# Altium schematic sheet Sheet1-new.SchDoc: SMART METER - MainBoard
size A3; SheetNumber: 1
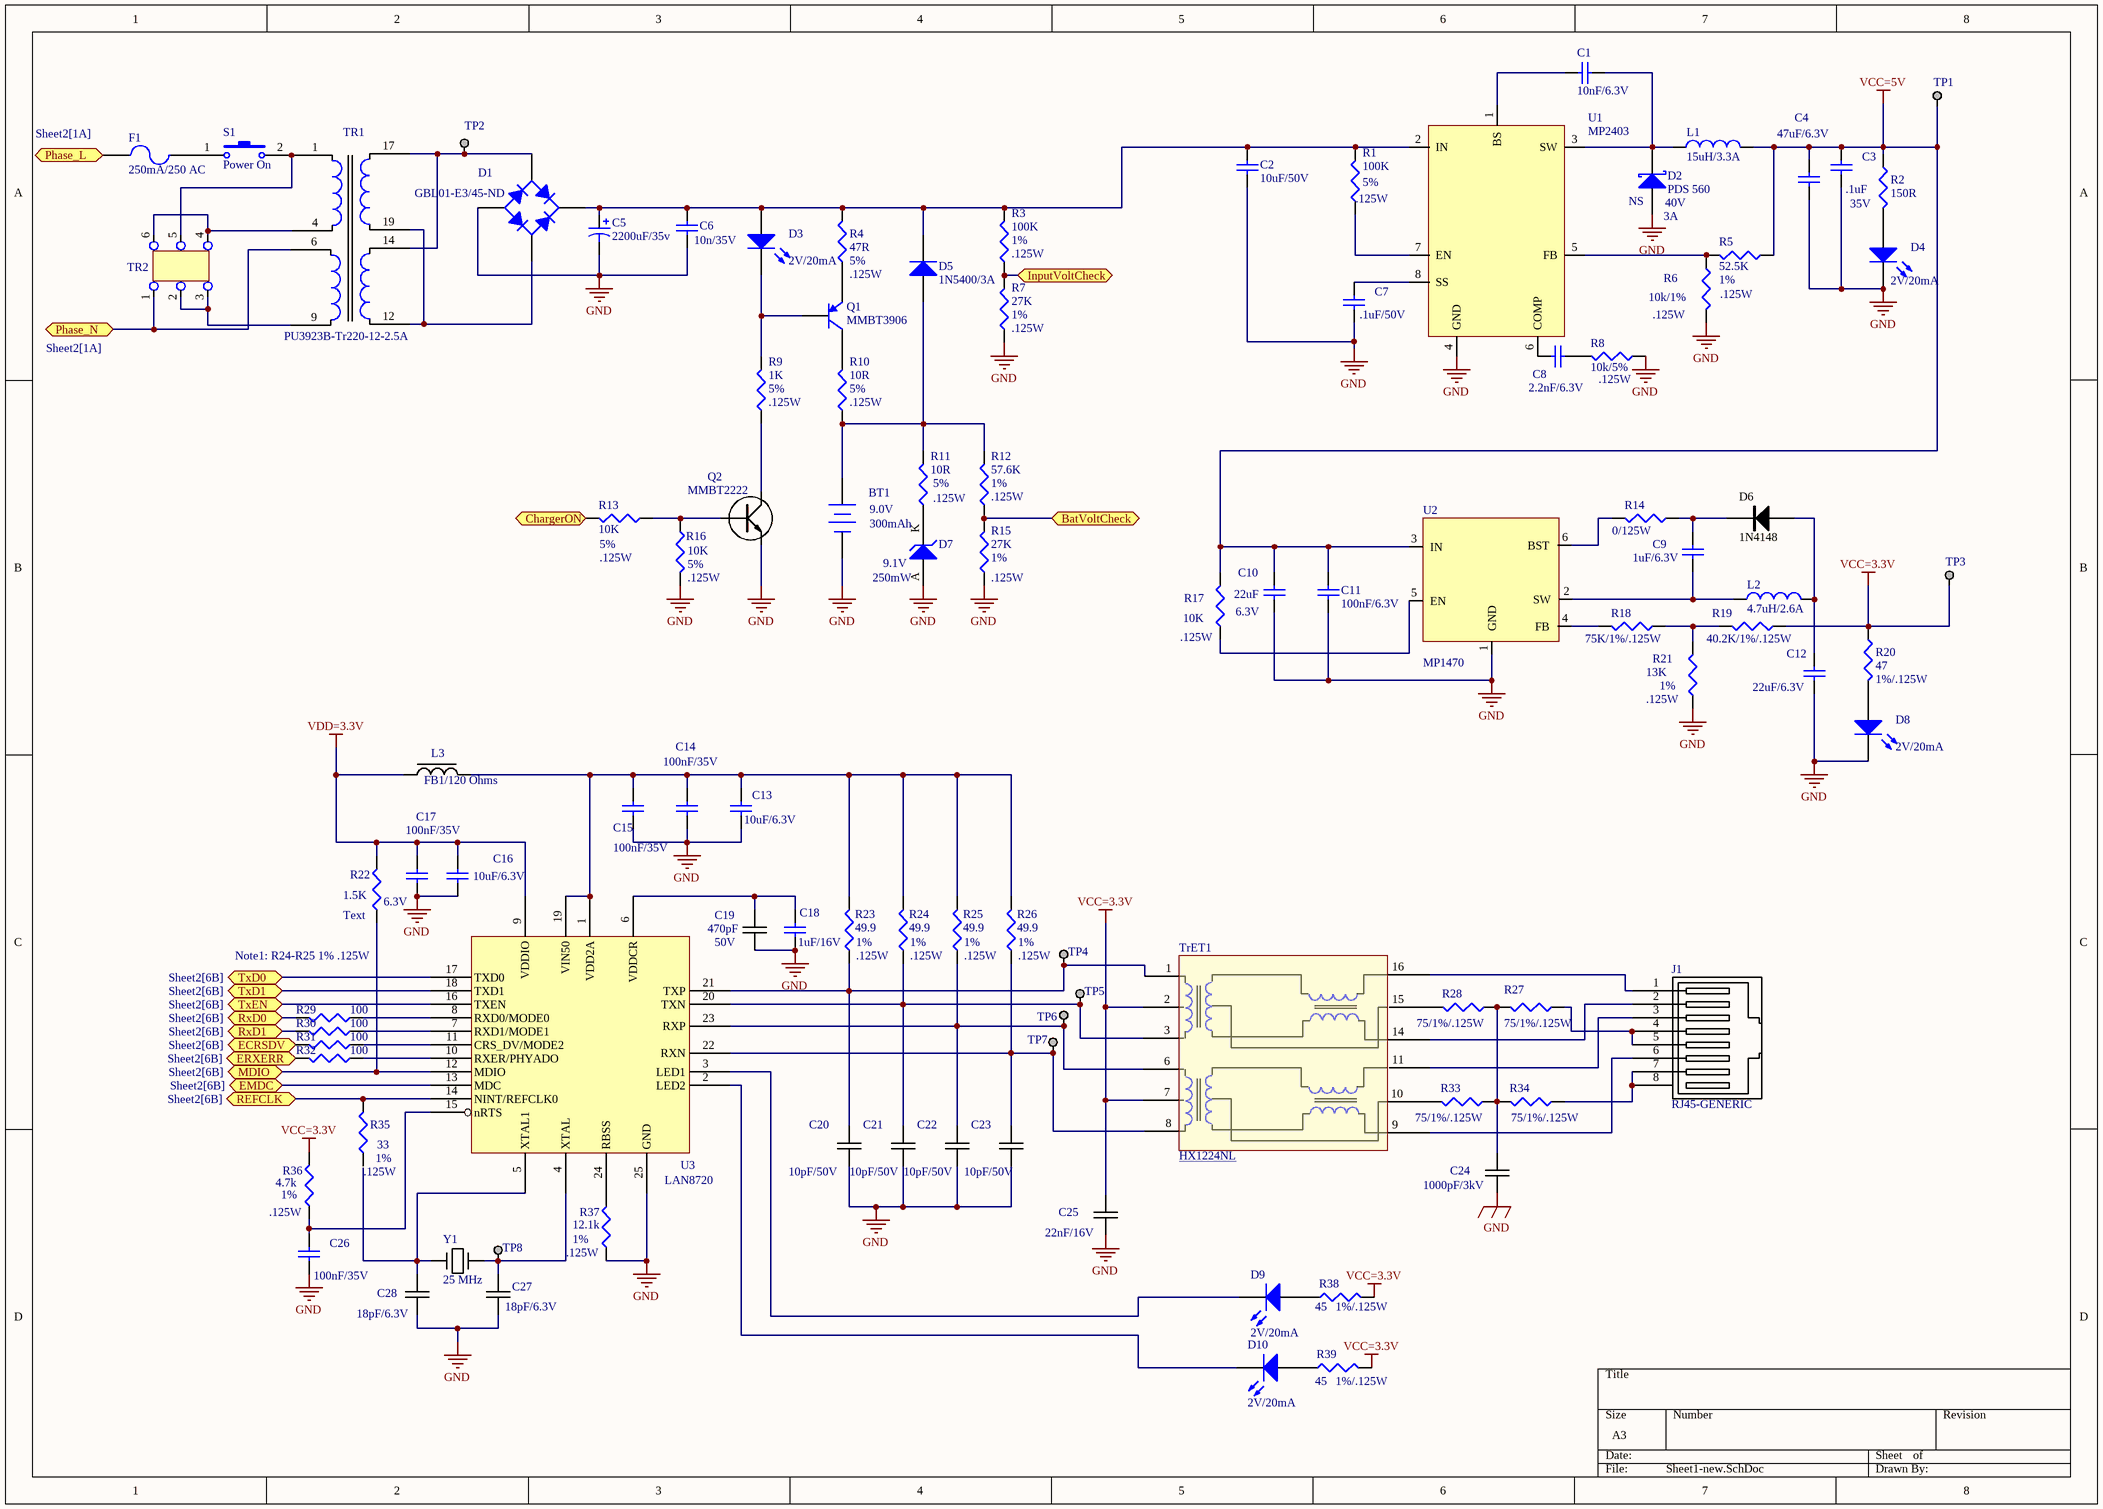
[diagram p0: Sheet1-new.SchDoc]

## Parts
BT1  9.0V  [BAT-2]
C1  10nF/6.3V  [0402C-GENERIC]
C2  10uF/50V  [1206C-GENERIC]
C3  .1uF  [0402C-GENERIC]
C4  47uF/6.3V  [1210C-GENERIC]
C5  2200uF/35v  [2200uF-Nichicon]
C6  10n/35V  [0402C-GENERIC]
C7  .1uF/50V  [0603C-GENERIC]
C8  2.2nF/6.3V  [0402C-GENERIC]
C9  1uF/6.3V  [0603C-GENERIC]
C10  22uF  [1206C-GENERIC]
C11  100nF/6.3V  [0805C-GENERIC]
C12  22uF/6.3V  [1206C-GENERIC]
C13  10uF/6.3V  [0805C-GENERIC]
C14  100nF/35V  [0402C-GENERIC]
C15  100nF/35V  [0402C-GENERIC]
C16  10uF/6.3V  [0805C-GENERIC]
C17  100nF/35V  [0402C-GENERIC]
C18  1uF/16V  [0402C-GENERIC]
C19  470pF  [0402C-GENERIC]
C20  10pF/50V  [0402C-GENERIC]
C21  10pF/50V  [0402C-GENERIC]
C22  10pF/50V  [0402C-GENERIC]
C23  10pF/50V  [0402C-GENERIC]
C24  1000pF/3kV  [1808]
C25  22nF/16V  [0402C-GENERIC]
C26  100nF/35V  [0402C-GENERIC]
C27  18pF/6.3V  [0805C-TBD]
C28  18pF/6.3V  [0805C-TBD]
D1  GBL01-E3/45-ND  [DiodeBridge-Vishay 21x4]
D2  PDS 560  [SMB]
D3  2V/20mA  [LED-SM]
D4  2V/20mA  [LED-SM]
D5  1N5400/3A  [DO-41]
D6  1N4148  [SOD-123]
D7  9.1V  [SOT23-DIODE]
D8  2V/20mA  [LED-SM]
D9  2V/20mA  [LED-SM]
D10  2V/20mA  [LED-SM]
F1  250mA/250 AC  [FuseHolder - duplicate]
J1  RJ45-GENERIC  [RJ45-8/8]
L1  15uH/3.3A  [Murata 15uH inductor]
L2  4.7uH/2.6A  [Inductor 4.7/6.8]
L3  FB1/120 Ohms  [0603C-2U2]
Q1  MMBT3906  [SOT23-BCE]
Q2  MMBT2222  [MMBT2222]
R1  100K  [0805R-0R1]
R2  150R  [0805R-68]
R3  100K  [0805R-0R1]
R4  47R  [0805R-0R1]
R5  52.5K  [0805R-0R1]
R6  10k/1%  [0805R-0R1]
R7  27K  [0805R-0R1]
R8  10k/5%  [0805R-0R1]
R9  1K  [0805R-0R1]
R10  10R  [0805R-0R1]
R11  10R  [0805R-0R1]
R12  57.6K  [0805R-0R1]
R13  10K  [0805R-0R1]
R14  0/125W  [0805R-0R1]
R15  27K  [0805R-0R1]
R16  10K  [0805R-0R1]
R17  10K  [0805R-0R1]
R18  75K/1%/.125W  [0805R-0R1]
R19  40.2K/1%/.125W  [0805R-0R1]
R20  47  [0805R-68]
R21  13K  [0805R-0R1]
R22  1.5K  [0603R-0R]
R23  49.9  [0603R-0R]
R24  49.9  [0603R-0R]
R25  49.9  [0603R-0R]
R26  49.9  [0603R-0R]
R27  75/1%/.125W  [0603R-0R]
R28  75/1%/.125W  [0603R-0R]
R29  100  [0603R-0R]
R30  100  [0603R-0R]
R31  100  [0603R-0R]
R32  100  [0603R-0R]
R33  75/1%/.125W  [0603R-0R]
R34  75/1%/.125W  [0603R-0R]
R35  33  [0603R-0R]
R36  4.7k  [0603R-0R]
R37  12.1k  [0603R-0R]
R38  45  [0805R-68]
R39  45  [0805R-68]
S1  Power On  [PowerSwitch220v/5A]
TP1  TESTPOINT  [TESTPOINT]  (value not drawn)
TP2  TESTPOINT  [TESTPOINT]  (value not drawn)
TP3  TESTPOINT  [TESTPOINT]  (value not drawn)
TP4  TESTPOINT  [TESTPOINT]  (value not drawn)
TP5  TESTPOINT  [TESTPOINT]  (value not drawn)
TP6  TESTPOINT  [TESTPOINT]  (value not drawn)
TP7  TESTPOINT  [TESTPOINT]  (value not drawn)
TP8  TESTPOINT  [TESTPOINT]  (value not drawn)
TR1  PU3923B-Tr220-12-2.5A  [Transform220/110-12/3]
TR2  Tr-Switch  [6-pins Molex2x3-5Ahm]  (value not drawn)
TrET1  HX1224NL  [S558-5999-Ethtransf]
U1  MP2403  [MP2403]
U2  MP1470  [MP1470]
U3  LAN8720  [QFN24_4X4_N]
Y1  25 MHz  [25Mhz-oscl]

## Ports
BatVoltCheck, ChargerON, ECRSDV (see Sheet2[6B]), EMDC (see Sheet2[6B]), ERXERR (see Sheet2[6B]), InputVoltCheck, MDIO (see Sheet2[6B]), Phase_L (see Sheet2[1A]), Phase_N (see Sheet2[1A]), REFCLK (see Sheet2[6B]), RxD0 (see Sheet2[6B]), RxD1 (see Sheet2[6B]), TxD0 (see Sheet2[6B]), TxD1 (see Sheet2[6B]), TxEN (see Sheet2[6B])

## Nets
GND: BT1.2(-) C2.2 C3.2 C4.2 C5.2 C6.2 C7.2 C10.2 C11.1 C12.2 C13.2 C14.2 C15.2 C16.2 C17.2 C18.2 C19.2 C20.2 C21.2 C22.2 C23.2 C24.2 C25.2 C26.2 C27.2 C28.2 D1.3(A) D2.1(A) D4.2(K) D7.A D8.2(K) Q2.E R6.2 R7.1 R8.1 R15.1 R16.2 R21.1 R37.1 U1.4(GND) U2.1(GND) U3.25(GND)
VCC=3.3V: C25.1 R19.1 R20.1 R36.2 R38.2 R39.2 TP3.1 TrET1.2(TDCT) TrET1.7
VCC=5V: C3.1 C4.1 C10.1 C11.2 L1.2 R2.1 R5.1 R17.2 TP1.1 U2.3(IN)
VDD=3.3V: C16.1 C17.1 L3.1 R22.2 U3.9(VDDIO)
BatVoltCheck: R12.1 R15.2 ; port BatVoltCheck
ChargerON: R13.2 ; port ChargerON
ECRSDV: R31.2 ; port ECRSDV
EMDC: U3.13(MDC) ; port EMDC
ERXERR: R32.2 ; port ERXERR
InputVoltCheck: R3.1 R7.2 ; port InputVoltCheck
MDIO: R22.1 U3.12(MDIO) ; port MDIO
Phase_L: F1.1 ; port Phase_L
Phase_N: TR1.6 TR2.1 ; port Phase_N
REFCLK: R35.2 U3.14(NINT/REFCLK0) ; port REFCLK
RxD0: R29.2 ; port RxD0
RxD1: R30.2 ; port RxD1
TxD0: U3.17(TXD0) ; port TxD0
TxD1: U3.18(TXD1) ; port TxD1
TxEN: U3.16(TXEN) ; port TxEN
NetBT1_1: BT1.1(+) D5.1(A) R10.1 R11.2 R12.2
NetC1_1: C1.1 U1.1(BS)
NetC1_2: C1.2 D2.2(K) L1.1 U1.3(SW)
NetC2_1: C2.1 C5.1 C6.1 D1.1(K) D3.1(A) D5.2(K) R1.2 R3.2 R4.2 U1.2(IN)
NetC7_1: C7.1 U1.8(SS)
NetC8_1: C8.1 U1.6(COMP)
NetC8_2: C8.2 R8.2
NetC9_1: C9.1 D6.K R14.1
NetC9_2: C9.2 L2.1 U2.2(SW)
NetC12_1: C12.1 D6.A L2.2
NetC13_1: C13.1 C14.1 C15.1 L3.2 R23.2 R24.2 R25.2 R26.2 U3.1(VDD2A) U3.19(VIN50)
NetC18_1: C18.1 C19.1 U3.6(VDDCR)
NetC20_1: C20.1 R23.1 TP4.1 TrET1.1(TD+) U3.21(TXP)
NetC21_1: C21.1 R24.1 TP5.1 TrET1.3(TD-) U3.20(TXN)
NetC22_1: C22.1 R25.1 TP6.1 TrET1.6 U3.23(RXP)
NetC23_1: C23.1 R26.1 TP7.1 TrET1.8 U3.22(RXN)
NetC24_1: C24.1 R27.2 R28.1 R33.1 R34.2
NetC26_1: C26.1 R36.1 U3.15(nRTS)
NetC27_1: C27.1 TP8.1 U3.4(XTAL) Y1.2
NetC28_1: C28.1 U3.5(XTAL1) Y1.1
NetD1_2: D1.2(C) TR1.12 TR1.19
NetD1_4: D1.4(C) TP2.1 TR1.14 TR1.17
NetD3_2: D3.2(K) Q1.2(B) R9.2
NetD4_1: D4.1(A) R2.2
NetD7_K: D7.K R11.1
NetD8_1: D8.1(A) R20.2
NetD9_1: D9.1(A) R38.1
NetD9_2: D9.2(K) U3.3(LED1)
NetD10_1: D10.1(A) R39.1
NetD10_2: D10.2(K) U3.2(LED2)
NetF1_2: F1.2 S1.1
NetJ1_1: J1.1 TrET1.16(Tx+_16)
NetJ1_2: J1.2 TrET1.14
NetJ1_3: J1.3 TrET1.11
NetJ1_4: J1.4 J1.5 R27.1
NetJ1_6: J1.6 TrET1.9
NetJ1_7: J1.7 J1.8 R34.1
NetQ1_1: Q1.1(C) R10.2
NetQ1_3: Q1.3(E) R4.1
NetQ2_B: Q2.B R13.1 R16.1
NetQ2_C: Q2.C R9.1
NetR1_1: R1.1 U1.7(EN)
NetR5_2: R5.2 R6.1 U1.5(FB)
NetR14_2: R14.2 U2.6(BST)
NetR17_1: R17.1 U2.5(EN)
NetR18_1: R18.1 R19.2 R21.2
NetR18_2: R18.2 U2.4(FB)
NetR28_2: R28.2 TrET1.15
NetR29_1: R29.1 U3.8(RXD0/MODE0)
NetR30_1: R30.1 U3.7(RXD1/MODE1)
NetR31_1: R31.1 U3.11(CRS_DV/MODE2)
NetR32_1: R32.1 U3.10(RXER/PHYADO)
NetR33_2: R33.2 TrET1.10
NetR37_2: R37.2 U3.24(RBSS)
NetS1_2: S1.2 TR1.1 TR2.5
NetTR1_4: TR1.4 TR2.4 TR2.6
NetTR1_9: TR1.9 TR2.2 TR2.3

Not connected (* = marked no-connect by the designer): R35 1

## Notes on the sheet
- (near R3) 1%
- (near R1) .125W
- (near R1) 5%
- (near D2) NS
- (near D2) 3A
- (near D2) 40V
- 35V
- (near R4) 5%
- (near R4) .125W
- (near R3) .125W
- (near R7) 1%
- .125W
- 1%
- (near R6) .125W
- (near R7) .125W
- (near R8) .125W
- (near R9) 5%
- (near R9) .125W
- (near R10) 5%
- (near R10) .125W
- (near R11) 5%
- (near R11) .125W
- (near R12) 1%
- (near R12) .125W
- (near R13) 5%
- (near R16) 5%
- (near R16) .125W
- 300mAh
- (near D7) 250mW
- (near R15) 1%
- (near R15) .125W
- (near R17) .125W
- 6.3V
- (near R21) .125W
- (near R21) 1%
- (near R20) 1%/.125W
- (near R22) Text
- (near R22) 6.3V
- Note1: R24-R25 1% .125W
- 50V
- (near R23) 1%
- (near R23) .125W
- (near R24) 1%
- (near R24) .125W
- (near R25) 1%
- (near R25) .125W
- (near R26) 1%
- (near R26) .125W
- (near R35) .125W
- (near R35) 1%
- (near R36) .125W
- (near R36) 1%
- (near R37) .125W
- (near R37) 1%
- (near R38) 1%/.125W
- (near R39) 1%/.125W

## Library data of the parts
BT1 = Battery: Multicell Battery; Manufacturer: Guangdons China; Published: 24-Mar-1999; LatestRevisionDate: 17-Jul-2002; LatestRevisionNote: Re-released for DXP Platform.; PackageReference: BAT-2; Publisher: sunbangpower.en.alibaba.com; PackageDescription: Battery; 2 Leads; Supplier: Zoro; Price: 1
C1 = Cap: Capacitor; Manufacturer: Murata; Mfr.PN#: 490-6286-1-ND; Value: 100n; Published: 8-Jun-2000; LatestRevisionDate: 17-Jul-2002; LatestRevisionNote: Re-released for DXP Platform.; PackageReference: 0402; Publisher: Altium Limited; PackageDescription: Radial Cap, Thru-Hole; 2 Leads; 0.3 in Pin Spacing; Supplier: Digi-Key; Suppl.PN#: 490-6286-1-ND; Price: .049; Footprint: 0603
C2 = Cap: Capacitor; Manufacturer: Murata; Mfr.PN#: GRM31CR61H106KA12L; Suppl.PN#: 490-5961-1-ND; Published: 8-Jun-2000; PackageReference: RAD-0.3; Publisher: Altium Limited; LatestRevisionDate: 17-Jul-2002; LatestRevisionNote: Re-released for DXP Platform.; PackageDescription: Radial Cap, Thru-Hole; 2 Leads; 0.3 in Pin Spacing; Supplier: DigiKey
C3 C14 C15 C17 C26 = Cap: Capacitor; Manufacturer: Yaiyo Yuden; Mfr.PN#: GMK105BJ104KV-F; Value: 100n; Suppl.PN#: 587-1994-1-ND; Published: 8-Jun-2000; LatestRevisionDate: 17-Jul-2002; LatestRevisionNote: Re-released for DXP Platform.; PackageReference: 0402; Publisher: Altium Limited; PackageDescription: Radial Cap, Thru-Hole; 2 Leads; 0.3 in Pin Spacing; Supplier: Digi-Key; Price: .049; Footprint: 0603
C4 = Cap: Capacitor; Manufacturer: Murata; Mfr.PN#: GRM32ER70J476KE20L; Value: 47uF; Suppl.PN#: 490-5311-1-ND; Published: 8-Jun-2000; LatestRevisionDate: 17-Jul-2002; LatestRevisionNote: Re-released for DXP Platform.; PackageReference: 0402; Publisher: Altium Limited; PackageDescription: Radial Cap, Thru-Hole; 2 Leads; 0.3 in Pin Spacing; Supplier: Digi-Key; Price: .049; Footprint: 0603
C5 = Cap Pol1: Polarized Capacitor (Radial); Manufacturer: Nichicon; Mfr.PN#: UHE1V222MHD6; Suppl.PN#: 493-1597-ND; Published: 8-Jun-2000; LatestRevisionDate: 17-Jul-2002; LatestRevisionNote: Re-released for DXP Platform.; PackageReference: RB7.6-15; Publisher: Altium Limited; PackageDescription: Polarized Capacitor (Radial); 2 Leads; Value: 2200uF/35V; Supplier: DigiKey; Price: 0.385
C6 = Cap: Capacitor; Manufacturer: TDK Corporation; Mfr.PN#: CGJ3E2X7R1C103K080AA; Suppl.PN#: 445-7338-6-ND; Published: 8-Jun-2000; LatestRevisionDate: 17-Jul-2002; LatestRevisionNote: Re-released for DXP Platform.; PackageReference: 0402; Publisher: Altium Limited; PackageDescription: Radial Cap, Thru-Hole; 2 Leads; 0.3 in Pin Spacing; Value: 10n/35V; Supplier: Digi-Key; Price: .049; Footprint: 0603
C7 = Cap: Capacitor; Manufacturer: Kemet; Mfr.PN#: C0603C104M5RACTU; Value: 100n; Suppl.PN#: 399-7845-1-ND; Published: 8-Jun-2000; LatestRevisionDate: 17-Jul-2002; LatestRevisionNote: Re-released for DXP Platform.; PackageReference: 0402; Publisher: Altium Limited; PackageDescription: Radial Cap, Thru-Hole; 2 Leads; 0.3 in Pin Spacing; Supplier: Digi-Key; Price: .049; Footprint: 0603
C8 = Cap: Capacitor; Manufacturer: Murata; Mfr.PN#: GRM155R60J222KA01D; Value: 100n; Suppl.PN#: 490-11413-1-ND; Published: 8-Jun-2000; LatestRevisionDate: 17-Jul-2002; LatestRevisionNote: Re-released for DXP Platform.; PackageReference: 0402; Publisher: Altium Limited; PackageDescription: Radial Cap, Thru-Hole; 2 Leads; 0.3 in Pin Spacing; Supplier: Digi-Key; Price: .049; Footprint: 0603
C9 = Cap: Capacitor; Manufacturer: TDK Corporation; Mfr.PN#: CGJ3E2X7R1C103K080AA; Value: 10n; Suppl.PN#: 445-8130-1-ND; Published: 8-Jun-2000; LatestRevisionDate: 17-Jul-2002; LatestRevisionNote: Re-released for DXP Platform.; PackageReference: RAD-0.3; Publisher: Altium Limited; PackageDescription: Radial Cap, Thru-Hole; 2 Leads; 0.3 in Pin Spacing; Supplier: Digi-Key; Price: .049; Footprint: 0603
C10 C12 = Cap: Capacitor; Manufacturer: Murata; Mfr.PN#: GRM31CR60J226KE19L; Value: 100n; Suppl.PN#: 490-1824-2-ND; Published: 8-Jun-2000; LatestRevisionDate: 17-Jul-2002; LatestRevisionNote: Re-released for DXP Platform.; PackageReference: 0402; Publisher: Altium Limited; PackageDescription: Radial Cap, Thru-Hole; 2 Leads; 0.3 in Pin Spacing; Supplier: Digi-Key; Price: .049; Footprint: 0603
C11 = Cap: Capacitor; Manufacturer: Kemet; Mfr.PN#: C0805C104K9RACTU; Value: 100n; Suppl.PN#: 399-9155-1-ND; Published: 8-Jun-2000; LatestRevisionDate: 17-Jul-2002; LatestRevisionNote: Re-released for DXP Platform.; PackageReference: 0402; Publisher: Altium Limited; PackageDescription: Radial Cap, Thru-Hole; 2 Leads; 0.3 in Pin Spacing; Supplier: Digi-Key; Price: .049; Footprint: 0603
C13 C16 = Cap: Capacitor; Manufacturer: Murata; Mfr.PN#: GRM21BR60J106ME19L; Suppl.PN#: 490-1718-1-ND; Published: 8-Jun-2000; LatestRevisionDate: 17-Jul-2002; LatestRevisionNote: Re-released for DXP Platform.; PackageReference: 0402; Publisher: Altium Limited; PackageDescription: Radial Cap, Thru-Hole; 2 Leads; 0.3 in Pin Spacing; Value: 10uF/6.3V; Supplier: Digi-Key; Price: .049; Footprint: 0603
C18 = Cap: Capacitor; Manufacturer: TDK Corporation; Mfr.PN#: C1005X5R1C105K050BC; Value: 1uF/6.3V; Suppl.PN#: 445-4978-1-ND; Published: 8-Jun-2000; LatestRevisionDate: 17-Jul-2002; LatestRevisionNote: Re-released for DXP Platform.; PackageReference: 0402; Publisher: Altium Limited; PackageDescription: Radial Cap, Thru-Hole; 2 Leads; 0.3 in Pin Spacing; Supplier: Digi-Key; Price: .049; Footprint: 0603
C19 = 0805C-18PF-50V-C0G-JOH: CAPACITOR 0805 CERAMIC; Manufacturer: Murata; Mfr.PN#: GRM1555C1H471JA01D; Value: 470pF 50V; Suppl.PN#: 490-1297-1-ND; Supplier 1: Digi-Key; Supplier Part Number 1: 709-1171-2-ND; Supplier: Digi-Key; SMD: 0402; Price: 0.1
C20-C23 = 0805C-18PF-50V-C0G-JOH: CAPACITOR 0805 CERAMIC; Manufacturer: Murata; Mfr.PN#: GRM1555C1H100FA01D; Suppl.PN#: 490-6186-1-ND; Supplier 1: Digi-Key; Supplier Part Number 1: 709-1171-2-ND; Value: 10pF/50V; Supplier: Digi-Key; Price: .03; SMD: 0402
C24 = 0805C-18PF-50V-C0G-JOH: CAPACITOR 0805 CERAMIC; Manufacturer: Johanson Dielctrics Inc; Mfr.PN#: 302R29W102KV4E; Value: 1000pF; Suppl.PN#: 709-1047-1-ND; Supplier 1: Digi-Key; Supplier Part Number 1: 709-1171-2-ND; Supplier: 490-5407-6-ND; SMD: 1801; Price: .0096
C25 = 0805C-18PF-50V-C0G-JOH: CAPACITOR 0805 CERAMIC; Manufacturer: Murata Electronics; Mfr.PN#: GRM155R71H223KA12D; Value: 22nF; Suppl.PN#: 490-3884-1-ND; Supplier 1: Digi-Key; Supplier Part Number 1: 709-1171-2-ND; Supplier: 490-5407-6-ND; SMD: 0402; Price: .0096
C27 C28 = 0805C-18PF-50V-C0G-JOH: CAPACITOR 0805 CERAMIC; Manufacturer: Kemet; Mfr.PN#: CBR02C180F9GAC; Suppl.PN#: CBR02C180F9GAC-ND; Supplier 1: Digi-Key; Supplier Part Number 1: 709-1171-2-ND; Value: 18pF/6.3V; Supplier: Digi-Key; Price: .03; SMD: 0603
D1 = Bridge1: Full Wave Diode Bridge; Manufacturer: Vishay; Published: 8-Jun-2000; LatestRevisionDate: 29-May-2009; LatestRevisionNote: Sch pins A & K swapped.; DatasheetVersion: E2732B; PackageReference: D-38; Publisher: Altium Limited; PackageDescription: Bridge Rectifier; 4 Terminals; Body 9.4 x 9.4 mm (typ); Pitch 5.08 mm; MfrPN#: GBL01-E3/45; Supplier: Digi-Key; Suppl.PN#: GBL01-E3/45-ND; Price: 0.24
D2 = D Schottky: Schottky Diode; Published: 8-Jun-2000; LatestRevisionDate: 17-Jul-2002; LatestRevisionNote: Re-released for DXP Platform.; PackageReference: SMB; Publisher: Altium Limited; PackageDescription: DO-214-AA/SMB; 2 C-Bend Leads; Body 5.3 x 3.6 mm, inc. leads (LxW); Code_JEDEC: DO-214-AA
D3 D4 D8-D10 = LED2: Typical RED, GREEN, YELLOW, AMBER GaAs LED; Manufacturer: Lite-On Inc; Mfr.PN#: LTST-C191KGKT; Suppl.PN#: 160-1446-2-ND; Published: 8-Jun-2000; LatestRevisionDate: 17-Jul-2002; LatestRevisionNote: Re-released for DXP Platform.; PackageVersion: Feb-2002; PackageReference: 3.2X1.6X1.1; Publisher: Altium Limited; PackageDescription: SM LED; 2 Flat Leads; Supplier: Digi-Key; Price: .04
D5 = Diode 1N4007: 1 Amp General Purpose Rectifier; Manufacturer: NTE Electronics; Mfr.PN#: !n5400; Suppl.PN#: 33C7853; Published: 8-Jun-2000; LatestRevisionDate: 17-Jul-2002; LatestRevisionNote: Re-released for DXP Platform.; DatasheetVersion: 1998; PackageVersion: Aug-1999; PackageReference: DO-41; Publisher: Altium Limited; PackageDescription: Diode, Axial; Body 5.2 x 2.7 mm (LxDia. max), Lead Dia. 0.86 mm (max); Code_JEDEC: DO-204-AL; ComponentLink1Description: Manufacturer Link; ComponentLink1URL: http://www.fairchildsemi.com/; ComponentLink2Description: Datasheet; ComponentLink2URL: http://www.fairchildsemi.com/ds/1N%2F1N4001.pdf; Supplier: Newark; Price: .142
D6 = 1N4001: Manufacturer: Vishay; Mfr.PN#: 1N4148W-E3-18; Suppl.PN#: 1N4148W-E3-18CT-ND; Supplier: Digikey
D7 = D Zener: Zener Diode; Manufacturer: NXP Semi; Mfr.PN#: BZX84-C9V1,235; Suppl.PN#: MMBT3906LT1G; Published: 8-Jun-2000; LatestRevisionDate: 17-Jul-2002; LatestRevisionNote: Re-released for DXP Platform.; PackageReference: DIODE-0.7; Publisher: Altium Limited; PackageDescription: Diode, Thru-Hole; 2 Leads; 0.7 in Pin Spacing; Supplier: DigiKey
F1 = Fuse 2: Fuse; Manufacturer: Littlefuse Inc; Suppl.PN#: F2393-ND; MnfPN3: 021702.HXP; Suppl.PN#: 507-1252-ND; Published: 8-Jun-2000; LatestRevisionDate: 17-Jul-2002; LatestRevisionNote: Re-released for DXP Platform.; PackageReference: PIN-W2/E2.8; Publisher: Altium Limited; PackageDescription: Thru-Hole; 2 Leads; Supplier: Digi-Key; Price: .25
J1 = RJ45-GENERIC: GENERIC RJ45 CONNECTOR 8 PIN; Manufacturer: Assman WSW Components; Mfr.PN#: A-2004-2-4-LP-N-R; Suppl.PN#: AE10384-ND; Supplier: DigiKey
L1 = Inductor: Manufacturer: Murata; Mfr.PN#: 1217AS-H-150M=P3; Code_IEC: 1005; Value: 15uH; Suppl.PN#: 490-10784-1-ND; Published: 8-Jun-2000; LatestRevisionDate: 29-May-2009; LatestRevisionNote: IPC-7351 Footprint Added.; PackageReference: 0402-A; Publisher: Altium Limited; PackageDescription: Chip Inductor; Code_JEITA: 0402; Supplier: DigiKey; Price: .82
L2 = Inductor: Manufacturer: Bourns; Mfr.PN#: SDR7045-6R8M; Code_IEC: 1005; Value: 4.7uH; Suppl.PN#: 490-10791-1-ND; Published: 8-Jun-2000; LatestRevisionDate: 29-May-2009; LatestRevisionNote: IPC-7351 Footprint Added.; PackageReference: 0402-A; Publisher: Altium Limited; PackageDescription: Chip Inductor; Code_JEITA: 0402; mfr PN: *; Supplier: DigiKey; Price: .82
L3 = 1U-1239AS-TOKO: 1239AS-H-1R0N; Mfr.PN#: BLM18PG121SN1D; Manufacturer: Murata Electronics; Suppl.PN#: 490-1037-1-ND; Supplier: Digi-Key; Price: .288; SMD: look at dsheet
Q1 = PNP: PNP Bipolar Transistor; Manufacturer: On Semi; Mfr.PN#: MMBT3906LT1G; Suppl.PN#: MMBT3906LT1GOSCT-ND; Published: 8-Jun-2000; LatestRevisionDate: 29-May-2009; LatestRevisionNote: IPC-7351 Footprint Added.; PackageVersion: Aug-1999; PackageReference: SOT-23B; Publisher: Altium Limited; PackageDescription: 3-Pin SOT-23 Package 0.95 mm Pitch, 2.4 mm Lead Span; Supplier: DigiKey
Q2 = MMBT2222: BC847 SMALL SIGNAL NPN TRANSISTOR; Manufacturer: Diodes  Inc.; Mfr.PN#: MMBT2222A-7-F; Suppl.PN#: MMBT2222A-FDICT-ND; Supplier 1: Digi-Key; Supplier: Digi-Key; Package: SOT-323; Price: .03
R1 R3 = Res3: Resistor; Manufacturer: Yageo; Mfr.PN#: RC0805FR-07100KL; Suppl.PN#: 311-100KCRCT-ND; Published: 8-Jun-2000; LatestRevisionDate: 29-May-2009; LatestRevisionNote: IPC-7351 Footprint Added.; PackageReference: 0805; Publisher: Altium Limited; PackageDescription: Chip Resistor; Value: 100K; Supplier: DigiKey; Price: .0035
R2 R38 R39 = Res3: Resistor; Manufacrturer: Vishay Dale; Mfr.PN#: CRCW080545R0FKTA; Value: 45/.125/1%; Suppl.PN#: CRCW080545R0FKTA-ND; Published: 8-Jun-2000; LatestRevisionDate: 29-May-2009; LatestRevisionNote: IPC-7351 Footprint Added.; PackageReference: 0805; Publisher: Altium Limited; PackageDescription: Chip Resistor; mfr PN: *; Supplier: Digi-Key
R4 = Res3: Resistor; Manufacturer: Vishay Dale; Mfr.PN#: CRCW080543R0FKEA; Suppl.PN#: 541-43.0CCT-ND; Published: 8-Jun-2000; LatestRevisionDate: 29-May-2009; LatestRevisionNote: IPC-7351 Footprint Added.; PackageReference: 0805; Publisher: Altium Limited; PackageDescription: Chip Resistor; Value: 47R; Supplier: DigiKey; Price: .0035
R5 = Res3: Resistor; Manufacturer: Vishay Dale; Mfr.PN#: RCA0805100KFKEA; Suppl.PN#: 541-2230-1-ND; Published: 8-Jun-2000; LatestRevisionDate: 29-May-2009; LatestRevisionNote: IPC-7351 Footprint Added.; PackageReference: 0805; Publisher: Altium Limited; PackageDescription: Chip Resistor; Value: 52.5K; Supplier: Digi-Key; Price: .0035
R6 = Res3: Resistor; Manufacturer: Panasonic; Mfr.PN#: ERJ-6ENF1002V; Value: 10K; Suppl.PN#: P10.0KCCT-ND; Published: 8-Jun-2000; LatestRevisionDate: 29-May-2009; LatestRevisionNote: IPC-7351 Footprint Added.; PackageReference: 0805; Publisher: Altium Limited; PackageDescription: Chip Resistor; Supplier: Digi-Key; Price: .0035
R7 R15 = Res3: Resistor; Manufacturer: Yayeo; Mfr.PN#: RC0805FR-0727KL; Suppl.PN#: 311-27.0KCRCT-ND; Published: 8-Jun-2000; LatestRevisionDate: 29-May-2009; LatestRevisionNote: IPC-7351 Footprint Added.; PackageReference: 0805; Publisher: Altium Limited; PackageDescription: Chip Resistor; Value: 27K; Supplier: DigiKey; Price: .0035
R8 R14 = Res3: Resistor; Manufacturer: Vishay Dale; Mfr.PN#: RCA0805100KFKEA; Value: 100K; Suppl.PN#: 541-2230-1-ND; Published: 8-Jun-2000; LatestRevisionDate: 29-May-2009; LatestRevisionNote: IPC-7351 Footprint Added.; PackageReference: 0805; Publisher: Altium Limited; PackageDescription: Chip Resistor; Supplier: Digi-Key; Price: .0035
R9 = Res3: Resistor; Manufacturer: Yageo; Mfr.PN#: RC0805FR-071KL; Suppl.PN#: 311-1.00KCRCT-ND; Published: 8-Jun-2000; LatestRevisionDate: 29-May-2009; LatestRevisionNote: IPC-7351 Footprint Added.; PackageReference: 0805; Publisher: Altium Limited; PackageDescription: Chip Resistor; Value: 1K; Supplier: DigiKey; Price: .0035
R10 R11 = Res3: Resistor; Manufacturer: Panasonic; Mfr.PN#: ERJ-6ENF3242V; Suppl.PN#: 667-ERJ-6ENF3242V; Published: 8-Jun-2000; LatestRevisionDate: 29-May-2009; LatestRevisionNote: IPC-7351 Footprint Added.; PackageReference: 0805; Publisher: Altium Limited; PackageDescription: Chip Resistor; Value: 10R; Supplier: Mouser; Price: .0035
R12 = Res3: Resistor; Manufacturer: Panasonic; Mfr.PN#: ERJ-6ENF5762V; Suppl.PN#: 667-ERJ-6ENF5762V; Published: 8-Jun-2000; LatestRevisionDate: 29-May-2009; LatestRevisionNote: IPC-7351 Footprint Added.; PackageReference: 0805; Publisher: Altium Limited; PackageDescription: Chip Resistor; Value: 57.6K; Supplier: Mouser; Price: .0035
R13 R16 = Res3: Resistor; Manufacturer: Samsung; Mfr.PN#: RC2012103S; Suppl.PN#: 1276-5332-1-ND; Published: 8-Jun-2000; LatestRevisionDate: 29-May-2009; LatestRevisionNote: IPC-7351 Footprint Added.; PackageReference: 0805; Publisher: Altium Limited; PackageDescription: Chip Resistor; Value: 10K; Supplier: DigiKey; Price: .0035
R17 = Res3: Resistor; Manufacturer: Panasonic; Mfr.PN#: ERJ-6ENF1002V; Value: 100K; Suppl.PN#: P10.0KCCT-ND; Published: 8-Jun-2000; LatestRevisionDate: 29-May-2009; LatestRevisionNote: IPC-7351 Footprint Added.; PackageReference: 0805; Publisher: Altium Limited; PackageDescription: Chip Resistor; Supplier: Digi-Key; Price: .0035
R18 = Res3: Resistor; Manufacturer: Panasonic; Mfr.PN#: ERJ-6ENF7502V; Value: 75K; Suppl.PN#: P75.0KCCT-ND; Published: 8-Jun-2000; LatestRevisionDate: 29-May-2009; LatestRevisionNote: IPC-7351 Footprint Added.; PackageReference: 0805; Publisher: Altium Limited; PackageDescription: Chip Resistor; Supplier: Digikey; Price: .0035
R19 = Res3: Resistor; Manufacturer: Panasonic; Mfr.PN#: ERJ-6ENF4022V; Value: 100K; Suppl.PN#: 667-ERJ-6ENF4022V; Published: 8-Jun-2000; LatestRevisionDate: 29-May-2009; LatestRevisionNote: IPC-7351 Footprint Added.; PackageReference: 0805; Publisher: Altium Limited; PackageDescription: Chip Resistor; Supplier: Mouser; Price: .0035
R20 = Res3: Resistor; Manufacrturer: Panasonic; Mfr.PN#: ERJ-6ENF47R0V; Value: 45/.125/1%; Suppl.PN#: P47.0CCT-ND; Published: 8-Jun-2000; LatestRevisionDate: 29-May-2009; LatestRevisionNote: IPC-7351 Footprint Added.; PackageReference: 0805; Publisher: Altium Limited; PackageDescription: Chip Resistor; mfr PN: *; Supplier: Digi-Key
R21 = Res3: Resistor; Manufacturer: Bourns; Mfr.PN#: CR0805-FX-1302ELF; Suppl.PN#: 652-CR0805FX-1302ELF; Published: 8-Jun-2000; LatestRevisionDate: 29-May-2009; LatestRevisionNote: IPC-7351 Footprint Added.; PackageReference: 0805; Publisher: Altium Limited; PackageDescription: Chip Resistor; Value: 13K; Supplier: Mouser; Price: .0035
R22 = Res3: Resistor; Manufacturer: Stackpole Electronics; Value: 1.5k/ .125W /1%; Suppl.PN#: RNCP0603FID1K50CT-ND; Published: 8-Jun-2000; LatestRevisionDate: 29-May-2009; LatestRevisionNote: IPC-7351 Footprint Added.; PackageReference: J1-0603; Publisher: Altium Limited; PackageDescription: Chip Resistor; Supplier: Digi-Key; Price: .00266
R23-R26 = Res3: Resistor; Manufacturer: Vishay Beschlang; Mfr.PN#: MCT06030C4999FP500; Value: 49.9 .125W 1%; Suppl.PN#: MCT0603-449.9-CFCT-ND; Published: 8-Jun-2000; LatestRevisionDate: 29-May-2009; LatestRevisionNote: IPC-7351 Footprint Added.; PackageReference: 0805; Publisher: Altium Limited; PackageDescription: Chip Resistor; Supplier: Digi-Key; Price: .0026
R27 R28 R33 R34 = Res3: Resistor; Manufacturer: Stackpole Electronics; Mfr.PN#: RNCP0603FTD75R0; Value: 75 1% .125; Suppl.PN#: RNCP0603FTD75R0CT-ND; Published: 8-Jun-2000; LatestRevisionDate: 29-May-2009; LatestRevisionNote: IPC-7351 Footprint Added.; PackageReference: 0805; Publisher: Altium Limited; PackageDescription: Chip Resistor; Supplier: Digi-Key; Price: .0026
R29-R32 = Res3: Resistor; Manufacturer: Stackpole Electronics; Value: 100 .125W 1%; Suppl.PN#: RNCP0603FTD100RCT-ND; Published: 8-Jun-2000; LatestRevisionDate: 29-May-2009; LatestRevisionNote: IPC-7351 Footprint Added.; PackageReference: 0805; Publisher: Altium Limited; PackageDescription: Chip Resistor; Supplier: Digi-Key; Price: .1
R35 = Res3: Resistor; Manufacturer: Vishay Beyschlang; Value: 33/ .125W 1%; Suppl.PN#: MCT0603-33.0-CFDKR-ND; Published: 8-Jun-2000; LatestRevisionDate: 29-May-2009; LatestRevisionNote: IPC-7351 Footprint Added.; PackageReference: J1-0603; Publisher: Altium Limited; PackageDescription: Chip Resistor; Supplier: Digi-Key; Price: .1
R36 = Res3: Resistor; Manufacturer: Vishay Beyschlang; Mfr.PN#: MCT06030C4701FP500; Value: 4.7k/ .125W 1%; Suppl.PN#: MCT0603-4.70K-CFCT-nd; Published: 8-Jun-2000; LatestRevisionDate: 29-May-2009; LatestRevisionNote: IPC-7351 Footprint Added.; PackageReference: J1-0603; Publisher: Altium Limited; PackageDescription: Chip Resistor; Supplier: Digi-Key; Price: .1
R37 = Res3: Resistor; Manufacturer: Vishay Beyschlang; Value: 12.1k/ .125W 1%; Suppl.PN#: MCT0603-12.1K-MBCT-ND; Published: 8-Jun-2000; LatestRevisionDate: 29-May-2009; LatestRevisionNote: IPC-7351 Footprint Added.; PackageReference: 0603; Publisher: Altium Limited; PackageDescription: Chip Resistor; Supplier: Digi-Key; Price: .1
S1 = WS-PBTL, 465RG11172501: WS-PBTL Illuminated THT Push button Switch; Manufacturer: Wurth Elektronik; Part No.: EG5195-ND; Manufacturer: China shanhai; ComponentLink1 Description: Manufacturer; ComponentLink2 Description: Datasheet; Suppl.PN#: AD12-112(12mm)green; Created Date: Dec.2015; ComponentLink1URL: http://www.we-online.com; ComponentLink2URL: http://katalog.we-online.de/em/datasheet/465RG11172501.pdf; Created by: Baojun Chen; Supplier: digikey
TP1-TP8 = TESTPOINT: TESTPOINT SCOPE GRABBER; Manufacturer Part Number: 5010; Manufacturer: Keystone Electronics; Reel: TH; Supplier 1: Digi-Key; Supplier Part Number 1: 5010K-ND
TR1 = PU3923B-Tr220-12-2.5A: Manufacturer: YHDC; Mfr.PN#: PU3923B
TR2 = Tr-Switch: Manufacturer: Molex; Mfr.PN#: 0878320607; Suppl.PN#: WM7145TR-ND; Supplier: Digi-key
TrET1 = S558-5999-Eth.TR: Manufacturer: Bel Fuse Inc; Suppl.PN#: 507-1463-1-ND; Supplier: DigiKey; Mfr.PN#: HX1224NL
U1 = MP2403: Manufacturer: MPS Inc; Mfr.PN#: MP2403DN-LF-Z; Suppl.PN#: MP2403DN-LF-Z-ND; Supplier: Digikey
U2 = MP1470: Manufacturer: MPS Inc; Mfr.PN#: MP1470GJ-P; Suppl.PN#: 1589-1018-1-ND; Supplier: DigiKey
U3 = LAN8720: Manufacturer: Microchip; Mfr.PN#: LAN8720A-CP-TR; Suppl.PN#: LAN8720A-CP-CT-ND; Supplier: Digi-key; Price: .76; SMD: 24 QFN
Y1 = CRYSTAL-GENERIC: GENERIC CRYSTAL; Manufacturer: Arbacon; Mfr.PN#: ABM7-25.000MHZ-D2Y-T; Suppl.PN#: 535-9847-1-ND; Value: 25 Mhz; Supplier: Digi-Key; Price: .4288